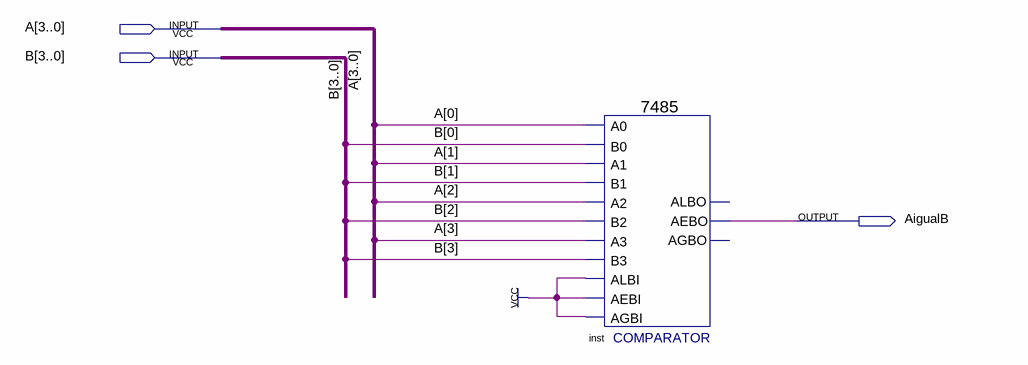
[diagram p0: schematic sheet]
// Quartus schematic Comparador.bdf as structural Verilog: 1 symbols, 3 pins
module Comparador (
  input  [3:0] A,
  input  [3:0] B,
  output AigualB
);

  \7485  inst (
    .A3(A[3]), .B2(B[2]), .A2(A[2]), .AEBI(1'b1), .AGBI(1'b1), .ALBI(1'b1), .A0(A[0]), .B0(B[0]), .B3(B[3]),
    .A1(A[1]), .B1(B[1]), .AEBO(AigualB));  // open: ALBO, AGBO
endmodule
